# Altium schematic sheet FlashNTemp.SchDoc
size A4; SheetNumber: 3; SheetTotal: 6
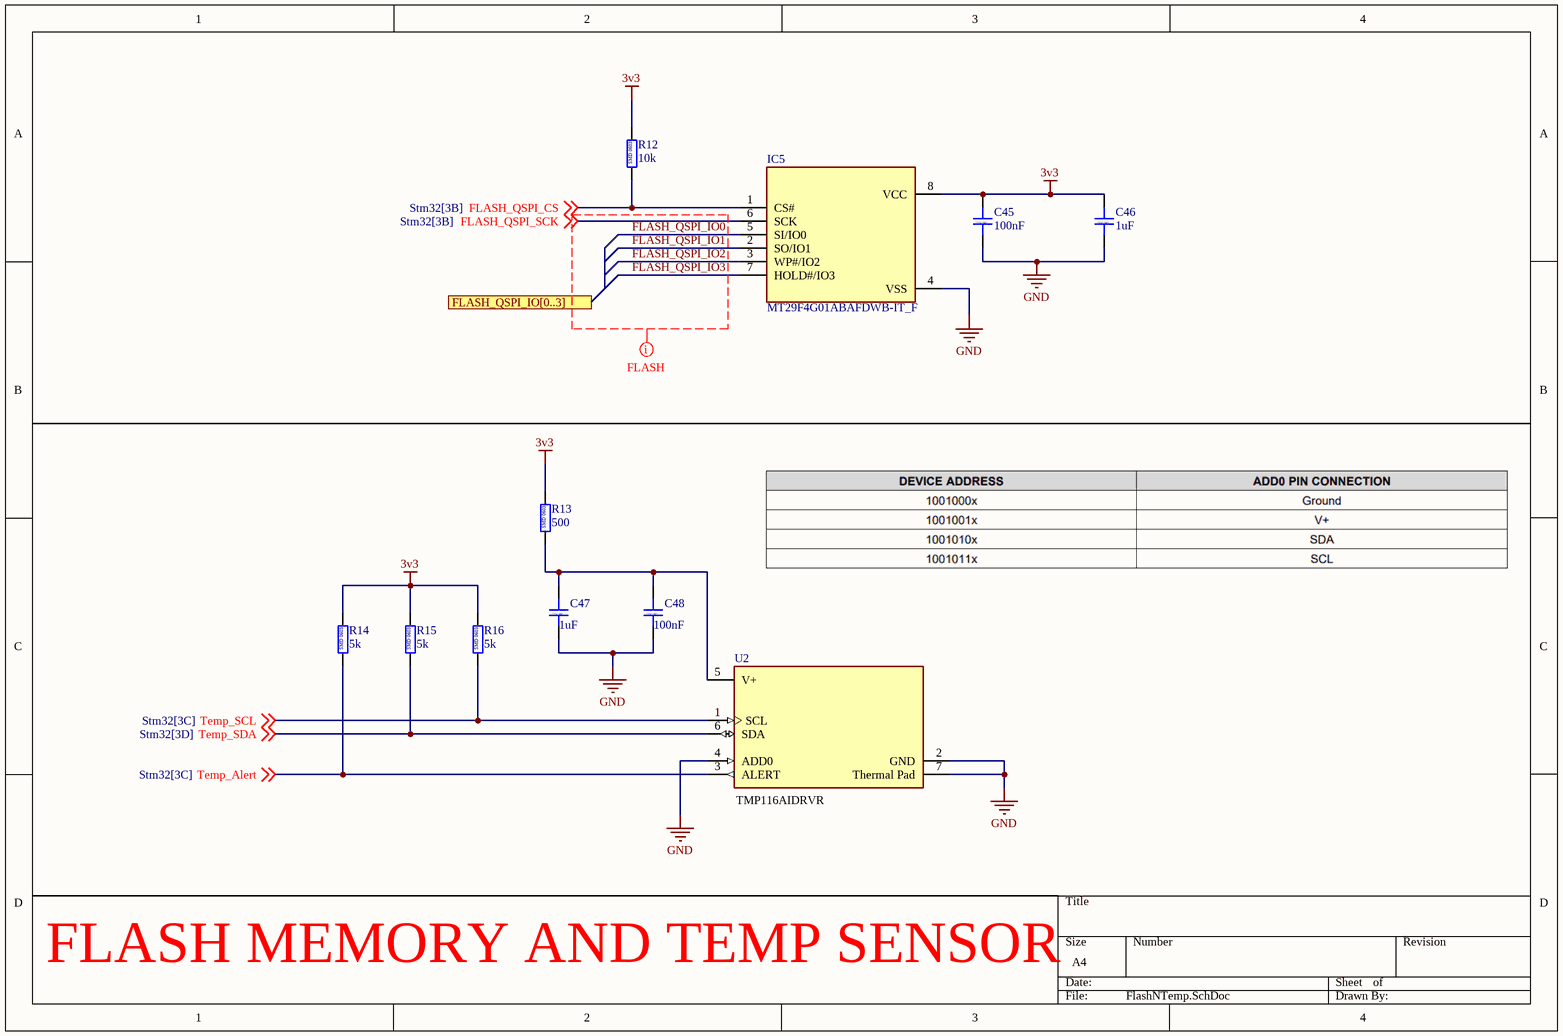
[diagram p0: FlashNTemp.SchDoc]

## Parts
C45  100nF  [CAP_0603]
C46  1uF  [CAP_0603]
C47  1uF  [CAP_0603]
C48  100nF  [CAP_0603]
IC5  MT29F4G01ABAFDWB-IT_F  [SON127P800X600X65-8N]
R12  10k  [RES_0603]
R13  500  [RES_0603]
R14  5k  [RES_0603]
R15  5k  [RES_0603]
R16  5k  [RES_0603]
U2  (no value)  [FP-DRV0006A-IPC_C]

## Ports
FLASH_QSPI_IO[0..3]

## Nets
3v3: C45.2 C46.2 IC5.8(VCC) R12.2 R13.2 R14.2 R15.2 R16.2
GND: C45.1 C46.1 C47.1 C48.1 IC5.4(VSS) U2.2(GND) U2.4(ADD0) U2.7(Thermal_Pad)
FLASH_QSPI_CS: IC5.1(CS#) R12.1 ; off-sheet FLASH_QSPI_CS
FLASH_QSPI_IO0: IC5.5(SI/IO0)
FLASH_QSPI_IO1: IC5.2(SO/IO1)
FLASH_QSPI_IO2: IC5.3(WP#/IO2)
FLASH_QSPI_IO3: IC5.7(HOLD#/IO3)
FLASH_QSPI_SCK: IC5.6(SCK) ; off-sheet FLASH_QSPI_SCK
Temp_Alert: R14.1 U2.3(ALERT) ; off-sheet Temp_Alert
Temp_SCL: R16.1 U2.1(SCL) ; off-sheet Temp_SCL
Temp_SDA: R15.1 U2.6(SDA) ; off-sheet Temp_SDA
NetC47_2: C47.2 C48.2 R13.1 U2.5(V+)

## Layout directives
net class FLASH: FLASH_QSPI_IO0, FLASH_QSPI_IO1, FLASH_QSPI_IO2, FLASH_QSPI_IO3, FLASH_QSPI_SCK

## Notes on the sheet
- (near U2) TMP116AIDRVR
- FLASH MEMORY AND TEMP SENSOR
- (in symbol Capacitor-SMD-0603) SMD 0603
- (in symbol Resistor-SMD-0603) SMD 0603

## Library data of the parts
C45-C48 = Capacitor-SMD-0603: Capacitor SMD 0603 RATED
IC5 = MT29F4G01ABAFDWB-IT_F: Integrated Circuit; Manufacturer_Name: Micron; Manufacturer_Part_Number: MT29F4G01ABAFDWB-IT:F; Datasheet Link: https://www.farnell.com/datasheets/3151403.pdf; Height: 0.65mm; Mouser Part Number: 340-359563; Mouser Price/Stock: https://www.mouser.co.uk/ProductDetail/Micron/MT29F4G01ABAFDWB-ITF?qs=wUXugUrL1qwrjb7To7JPbA%3D%3D; Arrow Part Number: MT29F4G01ABAFDWB-IT:F; Arrow Price/Stock: null?region=nac
R12-R16 = Resistor-SMD-0603: Resistor SMD 0603 RATED
U2 = CMP-04948-000045-1: SENSOR DIGITAL -55C-125C 6WSON; Resolution: 16b; Output Type: I2C; Mount: Surface Mount; Max Operating Temperature: 150°C; Interface: I2C; RoHS Compliant: Yes; Packaging: Tape and Reel; Min Operating Temperature: -55°C